# Altium schematic sheet Sch.schdoc
size A
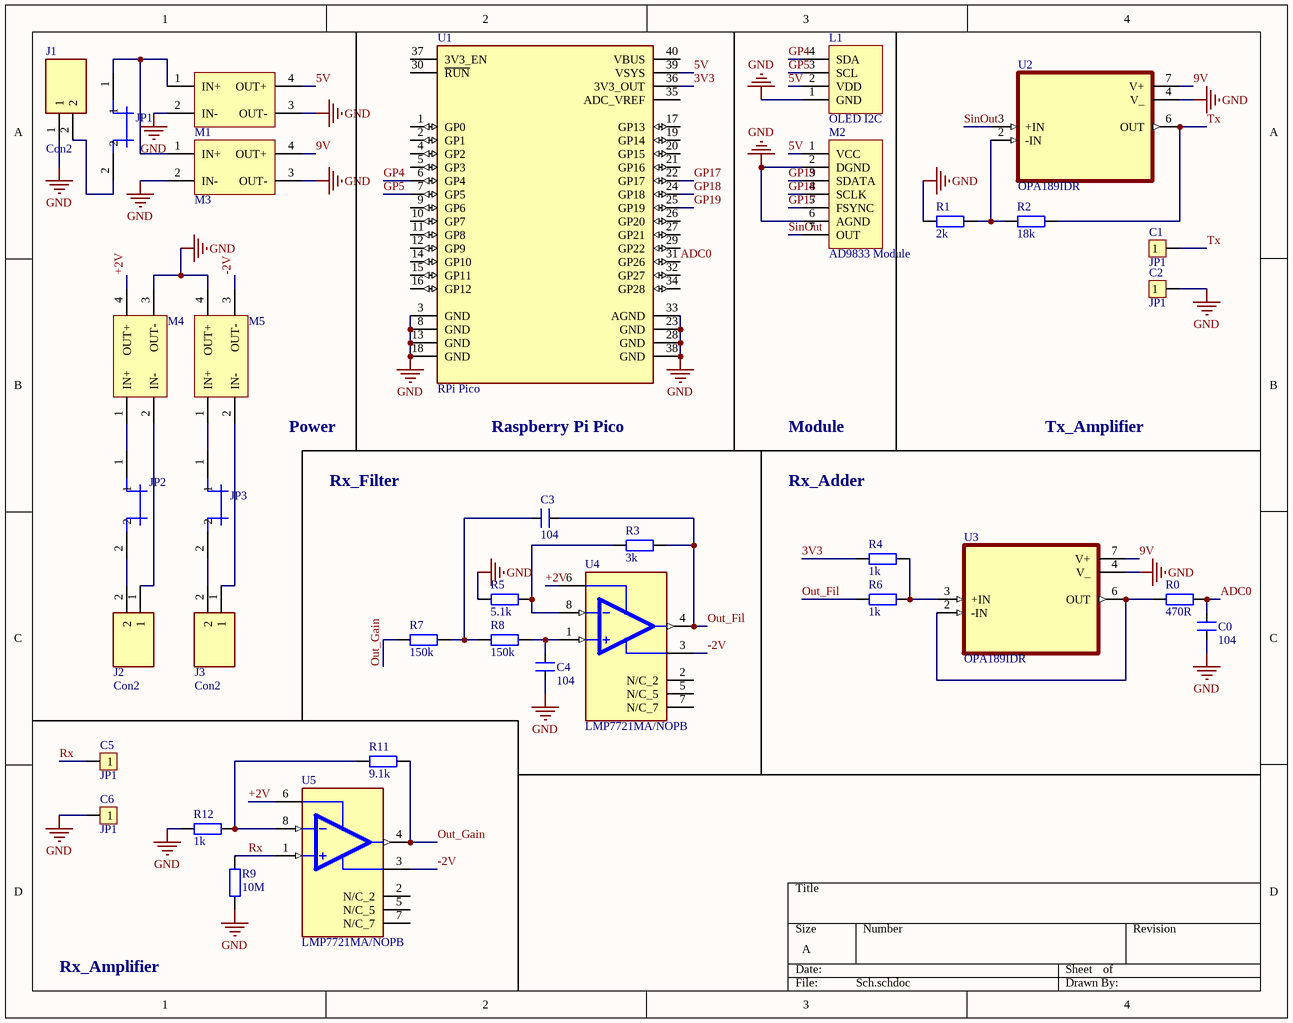
[diagram p0: Sch.schdoc]

## Parts
C0  104  [CN2]
C1  JP1  [JP1-D1T]
C2  JP1  [JP1-D1T]
C3  104  [CN2]
C4  104  [CN2]
C5  JP1  [JP1-D1T]
C6  JP1  [JP1-D1T]
J1  Con2  [Con_2]
J2  Con2  [Con_2]
J3  Con2  [Con_2]
JP1  Jump Con  [Jump_con]  (value not drawn)
JP2  Jump Con  [Jump_con]  (value not drawn)
JP3  Jump Con  [Jump_con]  (value not drawn)
L1  OLED I2C  [OLED_I2C]
M1  XL6009 Module  [XL6009_Module]  (value not drawn)
M2  AD9833 Module  [AD9833_Module]
M3  XL6009 Module  [XL6009_Module]  (value not drawn)
M4  LM2596S Module  [LM2596S_Module]  (value not drawn)
M5  LM2596S Module  [LM2596S_Module]  (value not drawn)
R0  470R  [R1/4W]
R1  2k  [R1/4W]
R2  18k  [R1/4W]
R3  3k  [R1/4W]
R4  1k  [R1/4W]
R5  5.1k  [R1/4W]
R6  1k  [R1/4W]
R7  150k  [R1/4W]
R8  150k  [R1/4W]
R9  10M  [R1/4W]
R11  9.1k  [R1/4W]
R12  1k  [R1/4W]
U1  RPi Pico  [RPI_PICO]
U2  OPA189IDR  [SOIC127P599X175-8N]
U3  OPA189IDR  [SOIC127P599X175-8N]
U4  LMP7721MA/NOPB  [SOIC127P599X175-8N - duplicate]
U5  LMP7721MA/NOPB  [SOIC127P599X175-8N - duplicate]

## Nets
GND: C0.1 C2.1 C4.1 C6.1 J1.1 L1.1(GND) M1.2(IN-) M1.3(OUT-) M2.2(DGND) M2.6(AGND) M3.2(IN-) M3.3(OUT-) M4.3(OUT-) M5.4(OUT+) R1.1 R5.1 R9.2 R12.2 U1.3(GND) U1.8(GND) U1.13(GND) U1.18(GND) U1.23(GND) U1.28(GND) U1.33(AGND) U1.38(GND) U2.4(V_) U3.4(V_)
3V3: R4.1 U1.36(3V3_OUT)
5V: L1.2(VDD) M1.4(OUT+) M2.1(VCC) U1.39(VSYS)
9V: M3.4(OUT+) U2.7(V+) U3.7(V+)
+2V: M4.4(OUT+) U4.6(V+) U5.6(V+)
-2V: M5.3(OUT-) U4.3(V-) U5.3(V-)
ADC0: C0.2 R0.2 U1.31(GP26)
GP4: L1.4(SDA) U1.6(GP4)
GP5: L1.3(SCL) U1.7(GP5)
GP17: M2.5(FSYNC) U1.22(GP17)
GP18: M2.4(SCLK) U1.24(GP18)
GP19: M2.3(SDATA) U1.25(GP19)
Out_Fil: C3.2 R3.2 R6.1 U4.4(VOUT)
Out_Gain: R7.1 R11.2 U5.4(VOUT)
Rx: C5.1 R9.1 U5.1(IN+)
SinOut: M2.7(OUT) U2.3(+IN)
Tx: C1.1 R2.2 U2.6(OUT)
NetC3_1: C3.1 R7.2 R8.1
NetC4_2: C4.2 R8.2 U4.1(IN+)
NetJ1_2: J1.2 JP1.2
NetJ2_1: J2.1 M4.2(IN-)
NetJ2_2: J2.2 JP2.2
NetJ3_1: J3.1 M5.2(IN-)
NetJ3_2: J3.2 JP3.2
NetJP1_1: JP1.1 M1.1(IN+) M3.1(IN+)
NetJP2_1: JP2.1 M4.1(IN+)
NetJP3_1: JP3.1 M5.1(IN+)
NetR0_1: R0.1 U3.2(-IN) U3.6(OUT)
NetR1_2: R1.2 R2.1 U2.2(-IN)
NetR3_1: R3.1 R5.2 U4.8(IN-)
NetR4_2: R4.2 R6.2 U3.3(+IN)
NetR11_1: R11.1 R12.1 U5.8(IN-)

Not connected (* = marked no-connect by the designer): U1 1(GP0) 2(GP1) 4(GP2) 5(GP3) 9(GP6) 10(GP7) 11(GP8) 12(GP9) 14(GP10) 15(GP11) 16(GP12) 17(GP13) 19(GP14) 20(GP15) 21(GP16) 26(GP20) 27(GP21) 29(GP22) 30(~{RUN}) 32(GP27) 34(GP28) 35(ADC_VREF) 37(3V3_EN) 40(VBUS); U4 2(N/C_2) 5(N/C_5) 7(N/C_7); U5 2(N/C_2) 5(N/C_5) 7(N/C_7)

## Notes on the sheet
- Power
- Raspberry Pi Pico
- Module
- Tx_Amplifier
- Rx_Filter
- Rx_Adder
- Rx_Amplifier

## Library data of the parts
C0 C3 C4 = CN2: Cap np 104 => 105pF; Value: 0.1uF
C1 C2 C5 C6 = JP1: WR-PHD 2.54 mm Angled Socket Header; Manufacturer: W¨¹rth Elektronik eiSos GmbH; partNo: 613002143121; ComponentLink1 Description: Manufacturer; ComponentLink2 Description: Datasheet; NoPins: 02; Created Date: 29 March 2013; ComponentLink1URL: http://www.we-online.com; ComponentLink2URL: http://katalog.we-online.de/em/datasheet/6130xx143121.pdf; Created by: Karrer Zheng
J1-J3 = Con2: MP: 4-1123723-2; Package: None; Price: None; Value: *; Availability: Unavailable
JP1-JP3 = Jump Con: Low Profile Jumper , Single Row, 2 Positions, 2.54mm (0.100in) Pitch; MF: FCI; MP: 68786-202LF; SnapEDA_Link: https://www.snapeda.com/parts/68786-202LF/Framatome%20Connectors/view-part/4792913/?ref=snap; Price: None; Package: None; Value: *; Check_prices: https://www.snapeda.com/parts/68786-202LF/Framatome%20Connectors/view-part/4792913/?ref=eda; Purchase-URL: https://pricing.snapeda.com/search/part/68786-202LF/?ref=eda; Availability: Good
R0-R9 R11 R12 = R1/4W: Resistor 1/4W; Value: R1/4W - 1K
U1 = RPi Pico: RP2040 Raspberry Pi Pico - ARM Cortex-M0+ MCU 32-Bit Embedded Evaluation Board; MP: SC0915; Availability: Unavailable; Package: None; Value: *; Price: None
U2 U3 = OPA189IDR: Single, 14MHz, MUX-friendly, low-noise, Zero-Drift, RRO, CMOS precision operational amplifier 8-SOIC -40 to 125; MF: Texas Instruments; Package: SOIC-8 Texas Instruments; DigiKey-Purchase-URL: https://snapeda.com/shop?store=DigiKey&id=2781858; MP: OPA189IDR; Arrow_Asia-Purchase-URL: https://snapeda.com/shop?store=Arrow+Asia&id=2781858; Mouser-Purchase-URL: https://snapeda.com/shop?store=Mouser&id=2781858; Digi-Key_Part_Number: 296-48941-1-ND; Texas_Instruments-Purchase-URL: https://snapeda.com/shop?store=Texas+Instruments&id=2781858; Value: *; SnapEDA_Link: https://www.snapeda.com/parts/OPA189IDR/Texas%20Instruments/view-part/2781858/?ref=snap
U4 U5 = LMP7721MA/NOPB: 3 Femtoampere Input Bias Current Precision Amplifier 8-SOIC -40 to 125; MF: Texas Instruments; Purchase-URL: https://pricing.snapeda.com/search/part/LMP7721MA/NOPB/?ref=eda; Package: SOIC-8 Texas Instruments; MP: LMP7721MA/NOPB; Price: None; Availability: Good; Value: *; Check_prices: https://www.snapeda.com/parts/LMP7721MA/NOPB/Texas%20Instruments/view-part/2634971/?ref=eda; SnapEDA_Link: https://www.snapeda.com/parts/LMP7721MA/NOPB/Texas%20Instruments/view-part/2634971/?ref=snap